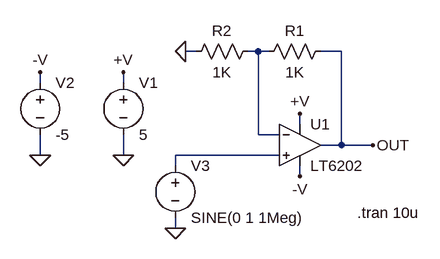
[diagram p0: schematic 6202.asc]
6202.asc, the LTspice schematic file:
Version 4
SHEET 1 896 680
WIRE 32 96 16 96
WIRE 128 96 112 96
WIRE 144 96 128 96
WIRE 256 96 224 96
WIRE -208 144 -208 128
WIRE -80 144 -80 128
WIRE 192 208 192 192
WIRE 128 224 128 96
WIRE 160 224 128 224
WIRE 256 240 256 96
WIRE 256 240 224 240
WIRE 304 240 256 240
WIRE -208 256 -208 224
WIRE -80 256 -80 224
WIRE 160 256 0 256
WIRE 0 272 0 256
WIRE 192 288 192 272
WIRE 0 368 0 352
FLAG -80 256 0
FLAG 192 192 +V
FLAG -80 128 +V
FLAG 192 288 -V
FLAG -208 256 0
FLAG -208 128 -V
FLAG 16 96 0
FLAG 0 368 0
FLAG 304 240 OUT
SYMBOL voltage -80 128 R0
SYMATTR InstName V1
SYMATTR Value 5
SYMBOL voltage -208 128 R0
SYMATTR InstName V2
SYMATTR Value -5
SYMBOL res 240 80 R90
WINDOW 0 0 56 VBottom 0
WINDOW 3 32 56 VTop 0
SYMATTR InstName R1
SYMATTR Value 1K
SYMBOL res 128 80 R90
WINDOW 0 0 56 VBottom 0
WINDOW 3 32 56 VTop 0
SYMATTR InstName R2
SYMATTR Value 1K
SYMBOL voltage 0 256 R0
SYMATTR InstName V3
SYMATTR Value SINE(0 1 1Meg)
SYMBOL opamps\\LT6202 192 240 R0
SYMATTR InstName U1
TEXT 280 344 Left 0 !.tran 10u

The netlist it stands for:
* 6202.asc
V1 +V 0 5
V2 -V 0 -5
R1 OUT N001 1K
R2 N001 0 1K
V3 N002 0 SINE(0 1 1Meg)
* U1: LT6202 (symbol opamps\LT6202 not available, pins judged from their places): In+=N002 In-=N001 V+=+V V-=-V OUT=OUT
.tran 10u
.backanno
.end